# Altium schematic sheet StuderA80ReproExtend_V0.3_XLR.SchDoc
size A4
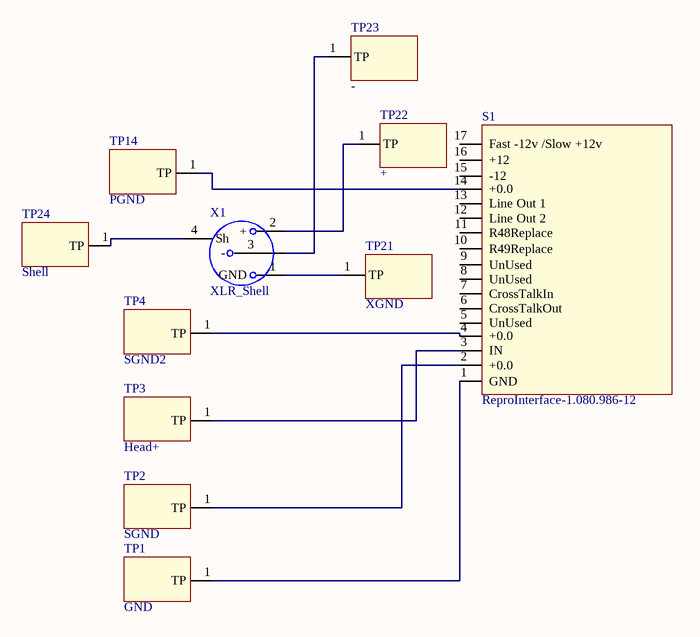
[diagram p0: StuderA80ReproExtend_V0.3_XLR.SchDoc]

## Parts
S1  ReproInterface-1.080.986-12  [ReproInterface]
TP1  GND  [TP-1.0mm]
TP2  SGND  [TP-1.0mm]
TP3  Head+  [TP-1.0mm]
TP4  SGND2  [TP-1.0mm]
TP14  PGND  [TP-1.0mm]
TP21  XGND  [TP-1.0mm]
TP22  +  [TP-1.0mm]
TP23  -  [TP-1.0mm]
TP24  Shell  [TP-1.0mm]
X1  XLR_Shell  [Neutrik-NC3FAAH-Shell]

## Nets
NetS1_1: S1.1(GND) TP1.1(TP)
NetS1_2: S1.2(+0.0) TP2.1(TP)
NetS1_3: S1.3(IN) TP3.1(TP)
NetS1_4: S1.4(+0.0) TP4.1(TP)
NetS1_14: S1.14(+0.0) TP14.1(TP)
NetTP21_1: TP21.1(TP) X1.1(GND)
NetTP22_1: TP22.1(TP) X1.2(+)
NetTP23_1: TP23.1(TP) X1.3(-)
NetTP24_1: TP24.1(TP) X1.4(Sh)

Not connected (* = marked no-connect by the designer): S1 5(UnUsed) 6(CrossTalkOut) 7(CrossTalkIn) 8(UnUsed) 9(UnUsed) 10(R49Replace) 11(R48Replace) 12(Line_Out_2) 13(Line_Out_1) 15(-12) 16(+12) 17(Fast_-12v_/Slow_+12v)

## Library data of the parts
S1 = ReproInterface-1.080.986-12: Studer A80 RC Reproduce Card 1.080.986-12 Interface
TP1-TP4 TP14 TP21-TP24 = TestPoint
X1 = XLR_Shell: 3 Pin XLR with Shell Pin